# EAGLE design stm32_tb_01 (EAGLE 9.5.2)
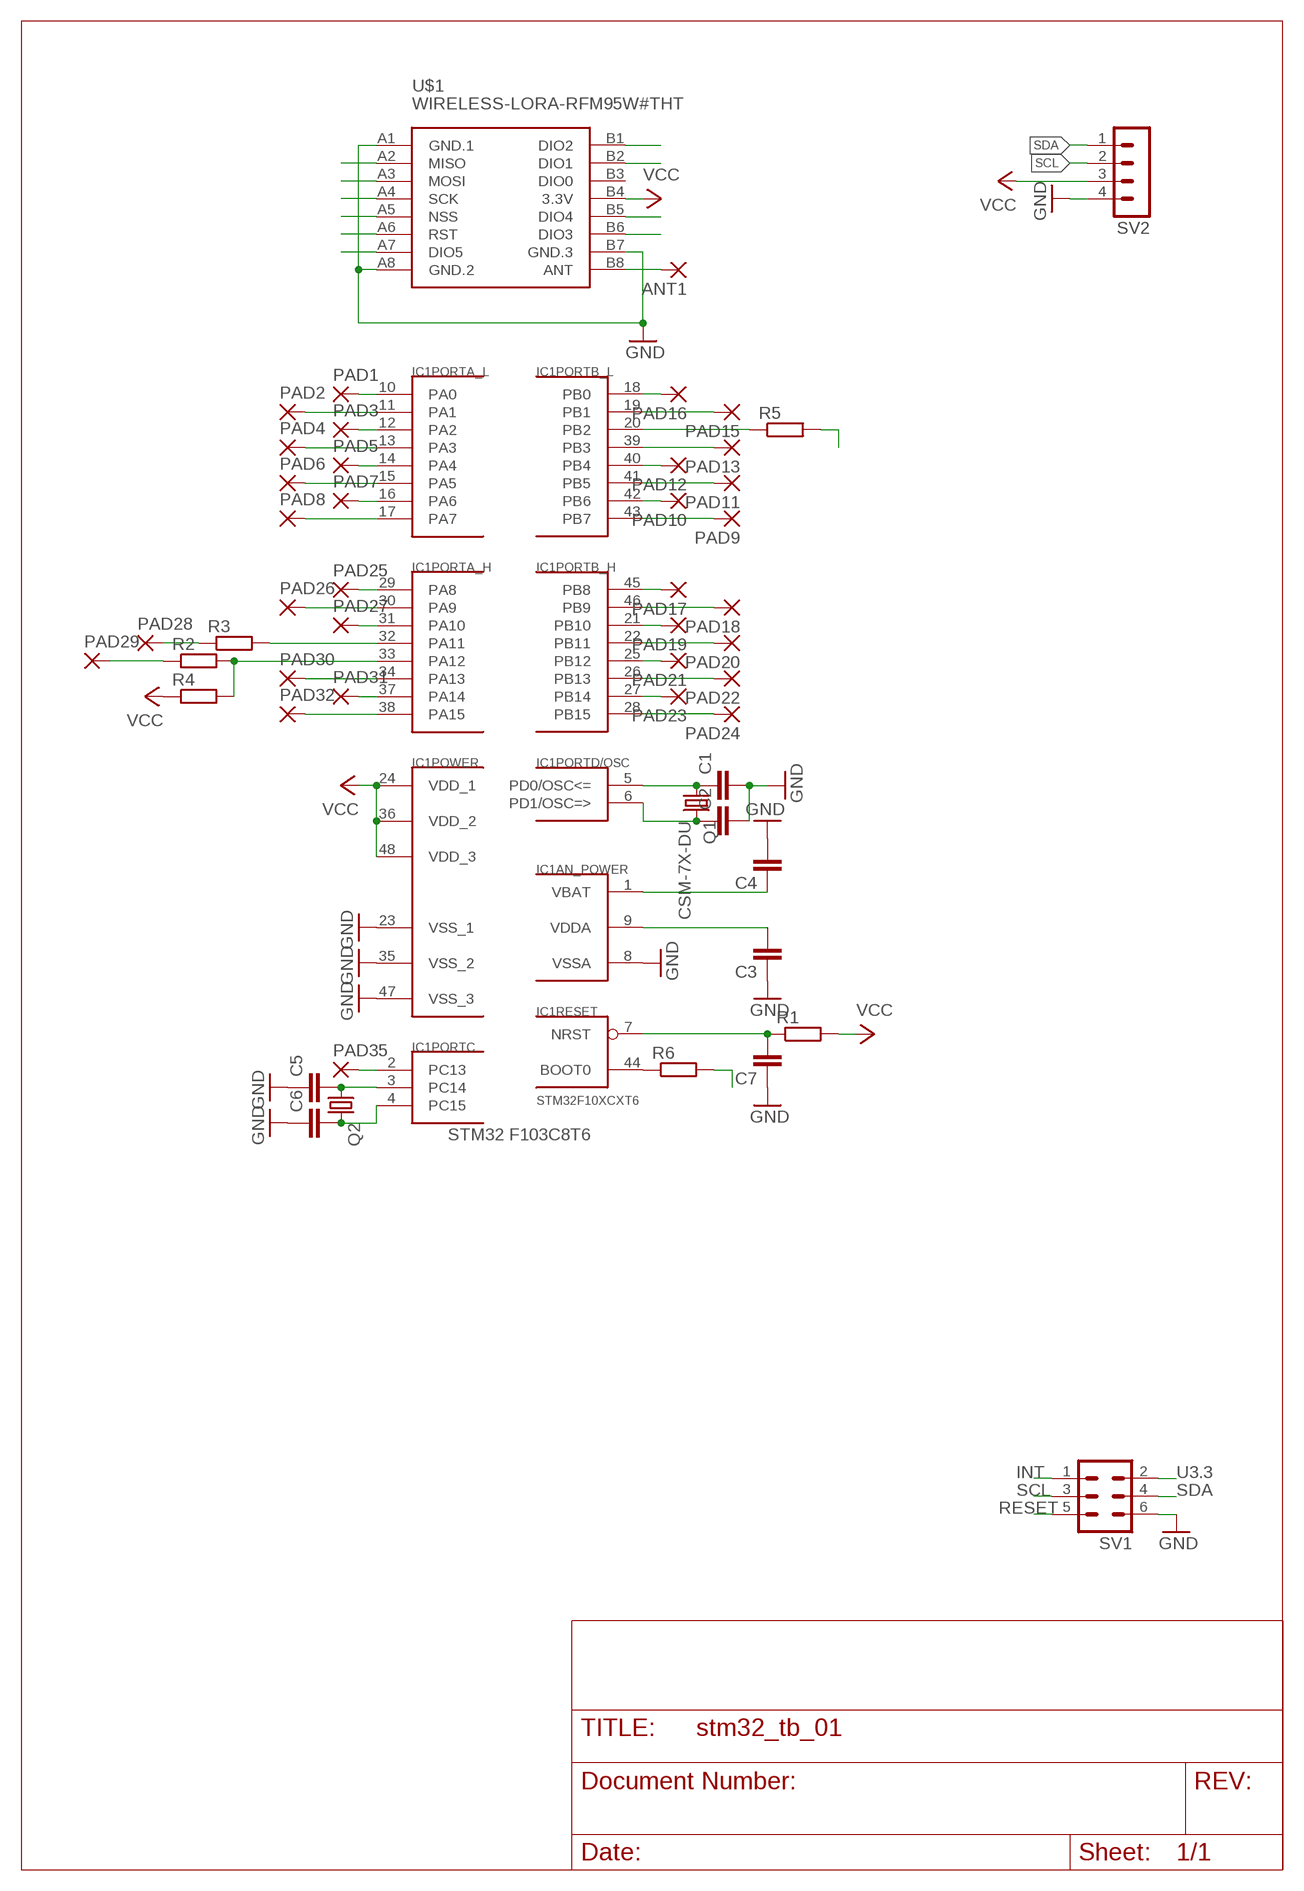
[diagram p0: schematic, sheet 1]

## Parts
ANT1  1,6/0,9  [1,6/0,9]
C1  C-EUC0805  [C0805]
C2  C-EUC0805  [C0805]
C3  C-EUC0805  [C0805]
C4  C-EUC0805  [C0805]
C5  C-EUC0805  [C0805]
C6  C-EUC0805  [C0805]
C7  C-EUC0805  [C0805]
IC1  STM32F10XCXT6  [TQFP48]
PAD1  1,6/0,9  [1,6/0,9]
PAD2  1,6/0,9  [1,6/0,9]
PAD3  1,6/0,9  [1,6/0,9]
PAD4  1,6/0,9  [1,6/0,9]
PAD5  1,6/0,9  [1,6/0,9]
PAD6  1,6/0,9  [1,6/0,9]
PAD7  1,6/0,9  [1,6/0,9]
PAD8  1,6/0,9  [1,6/0,9]
PAD9  1,6/0,9  [1,6/0,9]
PAD10  1,6/0,9  [1,6/0,9]
PAD11  1,6/0,9  [1,6/0,9]
PAD12  1,6/0,9  [1,6/0,9]
PAD13  1,6/0,9  [1,6/0,9]
PAD15  1,6/0,9  [1,6/0,9]
PAD16  1,6/0,9  [1,6/0,9]
PAD17  1,6/0,9  [1,6/0,9]
PAD18  1,6/0,9  [1,6/0,9]
PAD19  1,6/0,9  [1,6/0,9]
PAD20  1,6/0,9  [1,6/0,9]
PAD21  1,6/0,9  [1,6/0,9]
PAD22  1,6/0,9  [1,6/0,9]
PAD23  1,6/0,9  [1,6/0,9]
PAD24  1,6/0,9  [1,6/0,9]
PAD25  1,6/0,9  [1,6/0,9]
PAD26  1,6/0,9  [1,6/0,9]
PAD27  1,6/0,9  [1,6/0,9]
PAD28  1,6/0,9  [1,6/0,9]
PAD29  1,6/0,9  [1,6/0,9]
PAD30  1,6/0,9  [1,6/0,9]
PAD31  1,6/0,9  [1,6/0,9]
PAD32  1,6/0,9  [1,6/0,9]
PAD35  1,6/0,9  [1,6/0,9]
Q1  CSM-7X-DU  [CSM-7X-DU]
Q2  CRYSTALTC26V  [TC26V]
R1  R-EU_R0805  [R0805]
R2  R-EU_R0805  [R0805]
R3  R-EU_R0805  [R0805]
R4  R-EU_R0805  [R0805]
R5  R-EU_R0805  [R0805]
R6  R-EU_R0805  [R0805]
SV1  ML6  [ML6]
SV2  MA04-1  [MA04-1]
U$1  WIRELESS-LORA-RFM95W#THT  [WIRELESS-LORA-RFM95W#THT]

## Nets
GND [gnd]: C1.2 C2.2 C3.1 C4.2 C5.1 C6.1 C7.1 IC1.8(AN_POWER:VSSA) IC1.23(POWER:VSS_1) IC1.35(POWER:VSS_2) IC1.47(POWER:VSS_3) SV1.6 SV2.4 U$1.A1(GND.1) U$1.A8(GND.2) U$1.B7(GND.3)
INT: SV1.1
N$1: IC1.10(PORTA_L:PA0) PAD1.1(P)
N$2: IC1.11(PORTA_L:PA1) PAD2.1(P)
N$3: IC1.12(PORTA_L:PA2) PAD3.1(P)
N$4: IC1.13(PORTA_L:PA3) PAD4.1(P)
N$5: IC1.14(PORTA_L:PA4) PAD5.1(P)
N$6: IC1.15(PORTA_L:PA5) PAD6.1(P)
N$7: IC1.16(PORTA_L:PA6) PAD7.1(P)
N$8: IC1.17(PORTA_L:PA7) PAD8.1(P)
N$9: IC1.43(PORTB_L:PB7) PAD9.1(P)
N$10: IC1.42(PORTB_L:PB6) PAD10.1(P)
N$11: IC1.41(PORTB_L:PB5) PAD11.1(P)
N$12: IC1.40(PORTB_L:PB4) PAD12.1(P)
N$13: IC1.39(PORTB_L:PB3) PAD13.1(P)
N$14: IC1.20(PORTB_L:PB2) R5.1
N$15: IC1.19(PORTB_L:PB1) PAD15.1(P)
N$16: IC1.18(PORTB_L:PB0) PAD16.1(P)
N$17: IC1.45(PORTB_H:PB8) PAD17.1(P)
N$18: IC1.46(PORTB_H:PB9) PAD18.1(P)
N$19: IC1.21(PORTB_H:PB10) PAD19.1(P)
N$20: IC1.22(PORTB_H:PB11) PAD20.1(P)
N$21: IC1.25(PORTB_H:PB12) PAD21.1(P)
N$22: IC1.26(PORTB_H:PB13) PAD22.1(P)
N$23: IC1.27(PORTB_H:PB14) PAD23.1(P)
N$24: IC1.28(PORTB_H:PB15) PAD24.1(P)
N$25: IC1.29(PORTA_H:PA8) PAD25.1(P)
N$26: IC1.30(PORTA_H:PA9) PAD26.1(P)
N$27: IC1.31(PORTA_H:PA10) PAD27.1(P)
N$28: IC1.33(PORTA_H:PA12) R2.2 R4.2
N$29: IC1.32(PORTA_H:PA11) R3.2
N$30: IC1.34(PORTA_H:PA13) PAD30.1(P)
N$31: IC1.37(PORTA_H:PA14) PAD31.1(P)
N$32: IC1.38(PORTA_H:PA15) PAD32.1(P)
N$33: PAD28.1(P) R3.1
N$34: PAD29.1(P) R2.1
N$35: IC1.2(PORTC:PC13) PAD35.1(P)
N$36: C5.2 IC1.3(PORTC:PC14) Q2.1
N$37: C6.2 IC1.4(PORTC:PC15) Q2.2
N$38: IC1.44(RESET:BOOT0) R6.1
N$39: C1.1 IC1.5(PORTD/OSC:PD0/OSC<=) Q1.1
N$40: C2.1 IC1.6(PORTD/OSC:PD1/OSC=>) Q1.2
N$41: C3.2 IC1.9(AN_POWER:VDDA)
N$42: C4.1 IC1.1(AN_POWER:VBAT)
N$43: C7.2 IC1.7(RESET:NRST) R1.1
N$44: R5.2
N$45: R6.2
N$46: U$1.A2(MISO)
N$47: U$1.A3(MOSI)
N$48: U$1.A4(SCK)
N$49: U$1.A5(NSS)
N$50: U$1.A6(RST)
N$51: U$1.A7(DIO5)
N$52: U$1.B1(DIO2)
N$53: U$1.B2(DIO1)
N$54: U$1.B5(DIO4)
N$55: U$1.B6(DIO3)
N$56: ANT1.1(P) U$1.B8(ANT)
RESET: SV1.5
SCL: SV1.3 SV2.2
SDA: SV1.4 SV2.1
U3.3 [power]: SV1.2
VCC: IC1.24(POWER:VDD_1) IC1.36(POWER:VDD_2) IC1.48(POWER:VDD_3) R1.2 R4.1 SV2.3 U$1.B4(3.3V)
Unconnected: U$1.B3(DIO0)

## Notes on the sheet
- STM32 F103C8T6

## Library data of the parts
ANT1 PAD1-PAD13 PAD15-PAD32 PAD35 = wirepad:1,6/0,9: THROUGH-HOLE PAD
C1-C7 = rcl:C-EU: CAPACITOR, European symbol; SPICEPREFIX: C
IC1 = stm32(1):STM32F10XCXT6: ST STM32F101/103 48pin LQFP
Q1 = crystal:CSM-7X-DU: SMD CRYSTAL Source: www.ecsxtal.com .. Crystal 3.6864MHz CSM_7X_DU.PDF; OC_FARNELL: unknown; OC_NEWARK: unknown
Q2 = crystal:CRYSTAL: CRYSTAL; OC_FARNELL: unknown; OC_NEWARK: unknown
R1-R6 = rcl:R-EU_: RESISTOR, European symbol; SPICEPREFIX: R
SV1 = con-harting-ml:ML6: HARTING; OC_FARNELL: unknown; OC_NEWARK: unknown
SV2 = con-lstb:MA04-1: PIN HEADER; OC_FARNELL: unknown; OC_NEWARK: unknown
U$1 = diy-modules:WIRELESS-LORA-RFM95W: 868/915 MHz LoRa Radio Transceiver Module based on SX1276 chip Click here to find device on ebay.com <http://www.ebay.com/sch/RFM95W+transceiver>

## Net classes
1 gnd: width 0.381 mm, drill 0.381 mm
2 power: width 0.381 mm, drill 0.381 mm

## Board
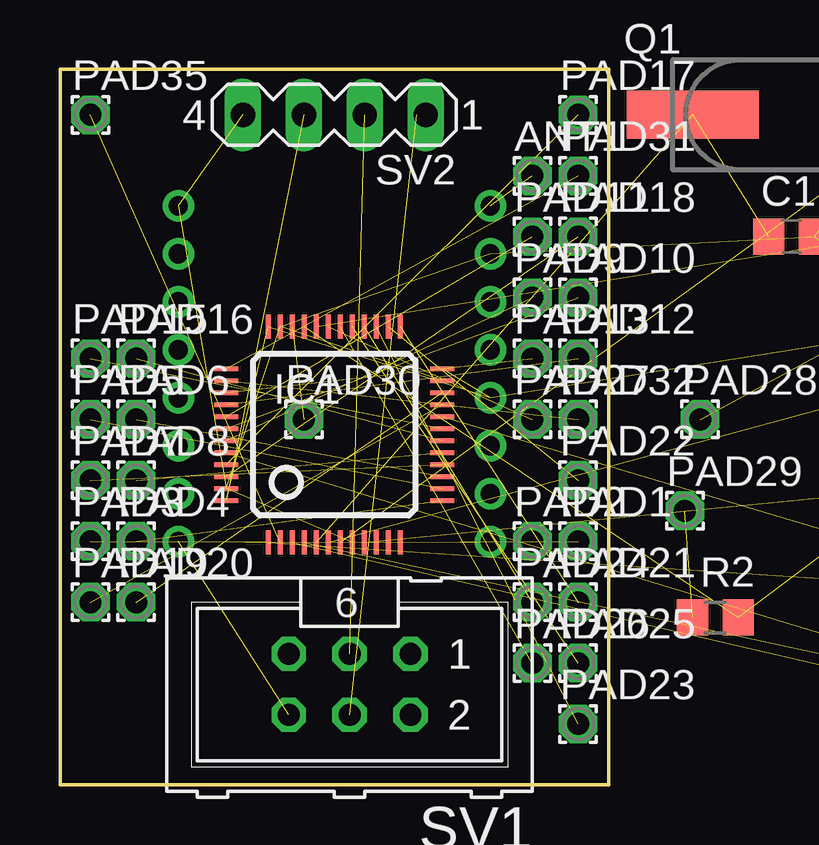
[diagram p1: board, top side]
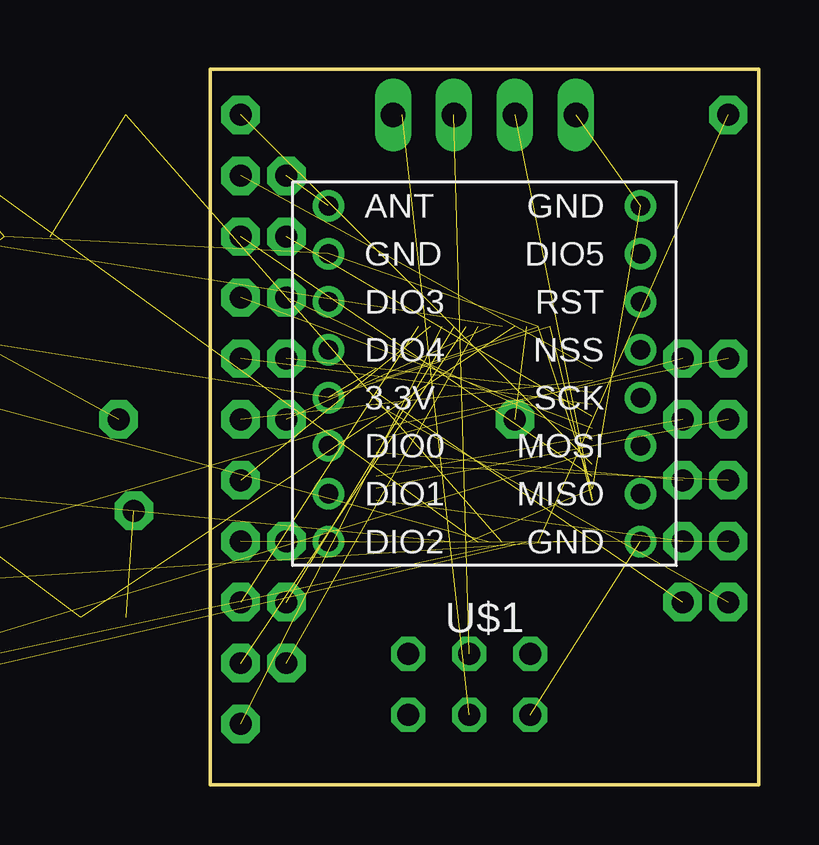
[diagram p2: board, bottom side, seen from below]

Size 22.86 x 29.84 mm. Coordinates in mm from the lower left corner, seen from the top.
Outline: 0,0 22.86,0 22.86,29.84 0,29.84 0,0
Copper layers (1*16): Top 0.035mm / dielectric 1.5mm / Bottom 0.035mm
Design rules "eagle": minimum track width 6mil, minimum drill 12mil, track to track 6mil, track to pad 6mil, pad to pad 6mil, via to via 6mil, smd to smd 0mil, copper to edge 10mil, drill to drill 10mil, minimum pad ring 10mil, minimum via ring 6mil, stop-mask expansion 2mil, vias tented up to drill 25mil, thermal gap 10mil

### Footprints (pad centres in the part's own frame; a part is rotated, then mirrored left to right if it is on the bottom)
1,6/0,9 = drill 0.914 pad 1.6 octagon: 1 0,0
C0805 = smd 1.3 x 1.5: 1 -0.95,0; 2 0.95,0
TQFP48 = smd 0.2 x 1: 1 -2.75,-4.5; 2 -2.25,-4.5; 3 -1.75,-4.5; 4 -1.25,-4.5; 5 -0.75,-4.5; 6 -0.25,-4.5; 7 0.25,-4.5; 8 0.75,-4.5; 9 1.25,-4.5; 10 1.75,-4.5; 11 2.25,-4.5; 12 2.75,-4.5; 25 2.75,4.5; 26 2.25,4.5; 27 1.75,4.5; 28 1.25,4.5; 29 0.75,4.5; 30 0.25,4.5; 31 -0.25,4.5; 32 -0.75,4.5; 33 -1.25,4.5; 34 -1.75,4.5; 35 -2.25,4.5; 36 -2.75,4.5 | smd 1 x 0.2: 13 4.5,-2.75; 14 4.5,-2.25; 15 4.5,-1.75; 16 4.5,-1.25; 17 4.5,-0.75; 18 4.5,-0.25; 19 4.5,0.25; 20 4.5,0.75; 21 4.5,1.25; 22 4.5,1.75; 23 4.5,2.25; 24 4.5,2.75; 37 -4.5,2.75; 38 -4.5,2.25; 39 -4.5,1.75; 40 -4.5,1.25; 41 -4.5,0.75; 42 -4.5,0.25; 43 -4.5,-0.25; 44 -4.5,-0.75; 45 -4.5,-1.25; 46 -4.5,-1.75; 47 -4.5,-2.25; 48 -4.5,-2.75
CSM-7X-DU = smd 5.5 x 2: 1 -4.75,0; 2 4.75,0
TC26V = drill 0.813: 1 -1.27,0; 2 1.27,0
R0805 = smd 1.3 x 1.5: 1 -0.95,0; 2 0.95,0
ML6 = drill 0.914 octagon: 1 -2.54,-1.27; 2 -2.54,1.27; 3 0,-1.27; 4 0,1.27; 5 2.54,-1.27; 6 2.54,1.27
MA04-1 = drill 1.016 long: 1 -3.81,0; 2 -1.27,0; 3 1.27,0; 4 3.81,0
WIRELESS-LORA-RFM95W#THT = drill 0.8: A1 -6.5,7; A2 -6.5,5; A3 -6.5,3; A4 -6.5,1; A5 -6.5,-1; A6 -6.5,-3; A7 -6.5,-5; A8 -6.5,-7; B1 6.5,7; B2 6.5,5; B3 6.5,3; B4 6.5,1; B5 6.5,-1; B6 6.5,-3; B7 6.5,-5; B8 6.5,-7

### Placement (x,y rotation side)
ANT1  19.68,25.4 0 top
C1  30.48,22.86 0 top  (outside the outline)
C2  38.1,17.14 0 top  (outside the outline)
C3  38.1,12.7 0 top  (outside the outline)
C4  38.1,8.26 0 top  (outside the outline)
C5  45.08,46.99 0 top  (outside the outline)
C6  45.08,42.55 0 top  (outside the outline)
C7  45.08,38.1 0 top  (outside the outline)
IC1  11.43,14.61 0 top
PAD1  21.59,10.16 0 top
PAD2  19.68,10.16 0 top
PAD3  1.27,10.16 0 top
PAD4  3.18,10.16 0 top
PAD5  1.27,15.24 0 top
PAD6  3.18,15.24 0 top
PAD7  1.27,12.7 0 top
PAD8  3.18,12.7 0 top
PAD9  19.68,20.32 0 top
PAD10  21.59,20.32 0 top
PAD11  19.68,22.86 0 top
PAD12  21.59,17.78 0 top
PAD13  19.68,17.78 0 top
PAD15  1.27,17.78 0 top
PAD16  3.18,17.78 0 top
PAD17  21.59,27.94 0 top
PAD18  21.59,22.86 0 top
PAD19  1.27,7.62 0 top
PAD20  3.18,7.62 0 top
PAD21  21.59,7.62 0 top
PAD22  21.59,12.7 0 top
PAD23  21.59,2.54 0 top
PAD24  19.68,7.62 0 top
PAD25  21.59,5.08 0 top
PAD26  19.68,5.08 0 top
PAD27  19.68,15.24 0 top
PAD28  26.67,15.24 0 top  (outside the outline)
PAD29  26.04,11.43 0 top  (outside the outline)
PAD30  10.16,15.24 0 top
PAD31  21.59,25.4 0 top
PAD32  21.59,15.24 0 top
PAD35  1.27,27.94 0 top
Q1  31.11,27.94 0 top  (outside the outline)
Q2  38.1,3.81 0 top  (outside the outline)
R1  45.08,33.66 0 top  (outside the outline)
R2  27.3,6.99 0 top  (outside the outline)
R3  45.08,24.77 0 top  (outside the outline)
R4  45.08,20.32 0 top  (outside the outline)
R5  45.08,6.99 0 top  (outside the outline)
R6  45.08,2.54 0 top  (outside the outline)
SV1  12.07,4.19 180 top
SV2  11.43,27.94 180 top
U$1  11.43,17.14 180 bottom

### Tracks (layer width: path | path; a pad name or v marks a point on that pad's centre or on a via)
GND  (15 unrouted)
N$1  (1 unrouted)
N$2  (1 unrouted)
N$3  (1 unrouted)
N$4  (1 unrouted)
N$5  (1 unrouted)
N$6  (1 unrouted)
N$7  (1 unrouted)
N$8  (1 unrouted)
N$9  (1 unrouted)
N$10  (1 unrouted)
N$11  (1 unrouted)
N$12  (1 unrouted)
N$13  (1 unrouted)
N$14  (1 unrouted)
N$15  (1 unrouted)
N$16  (1 unrouted)
N$17  (1 unrouted)
N$18  (1 unrouted)
N$19  (1 unrouted)
N$20  (1 unrouted)
N$21  (1 unrouted)
N$22  (1 unrouted)
N$23  (1 unrouted)
N$24  (1 unrouted)
N$25  (1 unrouted)
N$26  (1 unrouted)
N$27  (1 unrouted)
N$28  (2 unrouted)
N$29  (1 unrouted)
N$30  (1 unrouted)
N$31  (1 unrouted)
N$32  (1 unrouted)
N$33  (1 unrouted)
N$34  (1 unrouted)
N$35  (1 unrouted)
N$36  (2 unrouted)
N$37  (2 unrouted)
N$38  (1 unrouted)
N$39  (2 unrouted)
N$40  (2 unrouted)
N$41  (1 unrouted)
N$42  (1 unrouted)
N$43  (2 unrouted)
N$56  (1 unrouted)
SCL  (1 unrouted)
SDA  (1 unrouted)
  Bottom 0.152: 14.86,27.94 SV2.1
VCC  (6 unrouted)